# EAGLE design Trace_antenna_rfid_schem v1 (EAGLE 9.6.2)
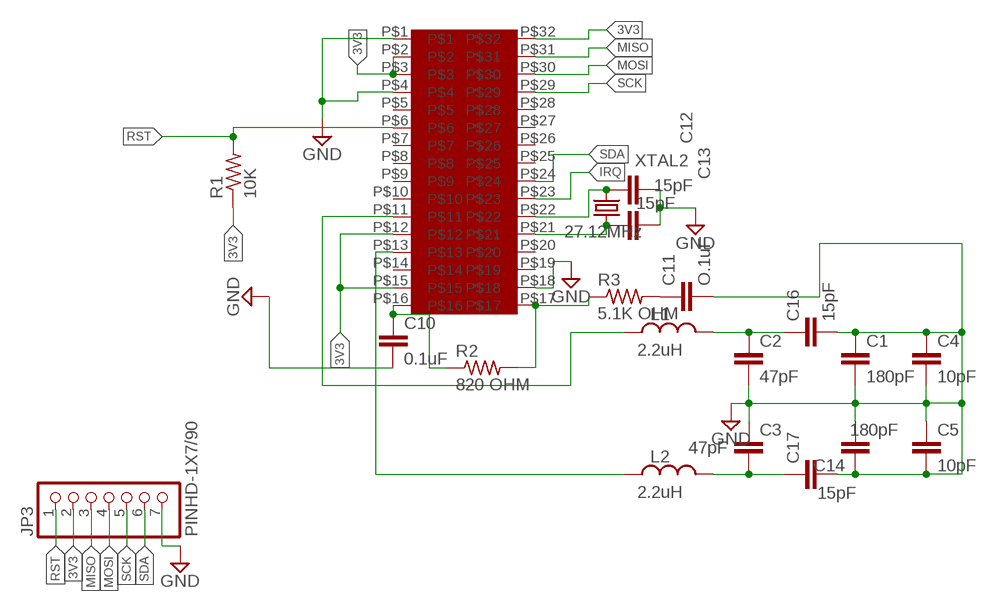
[diagram p0: schematic, sheet 1]

## Parts
C1  180pF  CAPACITOR_SMD_1206  [C1206]
C2  47pF  CAPACITOR_SMD_1206  [C1206]
C3  47pF  CAPACITOR_SMD_1206  [C1206]
C4  10pF  CAPACITOR_SMD_1206  [C1206]
C5  10pF  CAPACITOR_SMD_1206  [C1206]
C10  0.1uF  CAPACITOR_SMD_1206  [C1206]
C11  O.1uF  CAPACITOR_SMD_1206  [C1206]
C12  15pF  CAPACITOR_SMD_1206  [C1206]
C13  15pF  CAPACITOR_SMD_1206  [C1206]
C14  180pF  CAPACITOR_SMD_1206  [C1206]
C16  15pF  CAPACITOR_SMD_1206  [C1206]
C17  15pF  CAPACITOR_SMD_1206  [C1206]
JP3  PINHD-1X7/90  [1X07/90]
L1  2.2uH  L_CHIP-1206(3216-METRIC)  [INDC3216X190]
L2  2.2uH  L_CHIP-1206(3216-METRIC)  [INDC3216X190]
R1  10K  RESISTOR_SMD_1206  [M1206]
R2  820 OHM  RESISTOR_SMD_1206  [M1206]
R3  5.1K OHM  RESISTOR_SMD_1206  [M1206]
U$1  MFRC522_BREAKOUTBOARD  [BREAKOUT_BOARD_MFRC522]
XTAL2  27.12MHz  CRYSTAL_HC49-11.5L  [XTALRR488W45L1150T500H350B]

## Nets
3V3: JP3.2 R1.1 U$1.P$2 U$1.P$3 U$1.P$12 U$1.P$15 U$1.P$32
GND: C1.1 C1.2 C2.2 C3.1 C4.1 C4.2 C5.1 C5.2 C10.2 C11.2 C12.2 C13.2 C14.1 C14.2 C16.2 C17.2 JP3.7 U$1.P$1 U$1.P$4 U$1.P$18
IRQ: U$1.P$23
MISO: JP3.3 U$1.P$31
MOSI: JP3.4 U$1.P$30
N$1: C2.1 C16.1 L1.2
N$3: C3.2 C17.1 L2.2
N$15: C10.1 R2.1 U$1.P$16
N$16: R2.2 R3.1 U$1.P$17
N$17: C11.1 R3.2
N$18: C13.1 U$1.P$21 XTAL2.1
N$19: C12.1 U$1.P$22 XTAL2.2
N$20: L2.1 U$1.P$13
N$21: L1.1 U$1.P$11
RST: JP3.1 R1.2 U$1.P$6
SCK: JP3.5 U$1.P$29
SDA: JP3.6 U$1.P$24
Unconnected: U$1.P$5 U$1.P$7 U$1.P$8 U$1.P$9 U$1.P$10 U$1.P$14 U$1.P$19 U$1.P$20 U$1.P$25 U$1.P$26 U$1.P$27 U$1.P$28

## Library data of the parts
C1-C5 C10-C14 C16 C17 = BASIC_Components:CAPACITOR_SMD_1206
JP3 = Connector:PINHD-1X7: PIN HEADER; CATEGORY: CONNECTOR; SUB-CATEGORY: PIN-HEADER
L1 L2 = Inductor:L: Inductor Fixed - Generic; CATEGORY: Inductor; SUB-CATEGORY: Fixed
R1-R3 = BASIC_Components:RESISTOR_SMD_1206
U$1 = Breakout board mfrc522:MFRC522_BREAKOUTBOARD
XTAL2 = Frequency-Source:CRYSTAL: Crystal 2Pin - Generic; CATEGORY: Frequency-Source; SUB-CATEGORY: Crystal-2Pin; VALUE: HC49

## Board
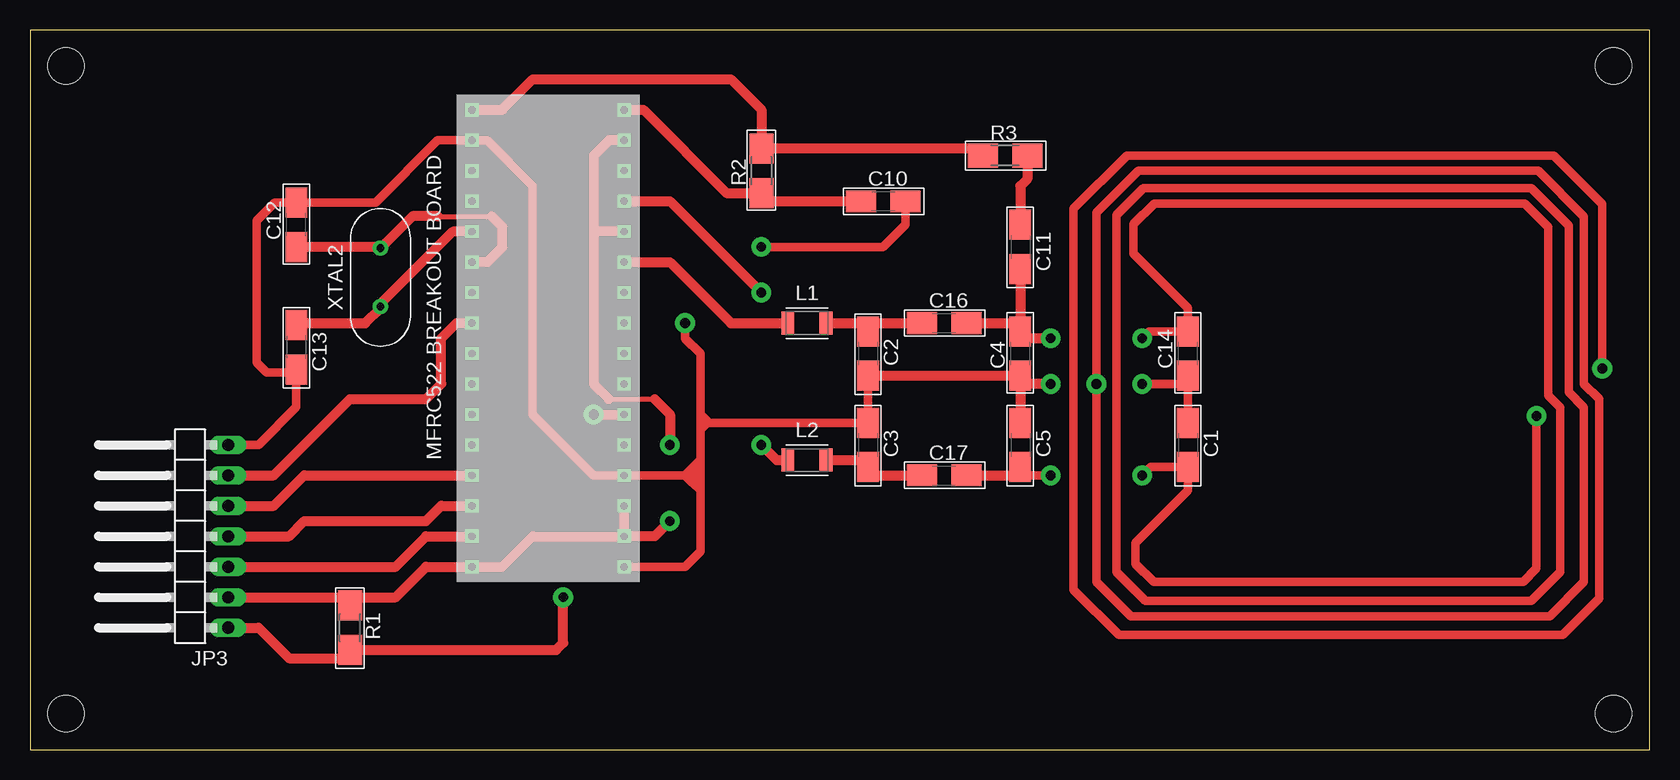
[diagram p1: board, top side]
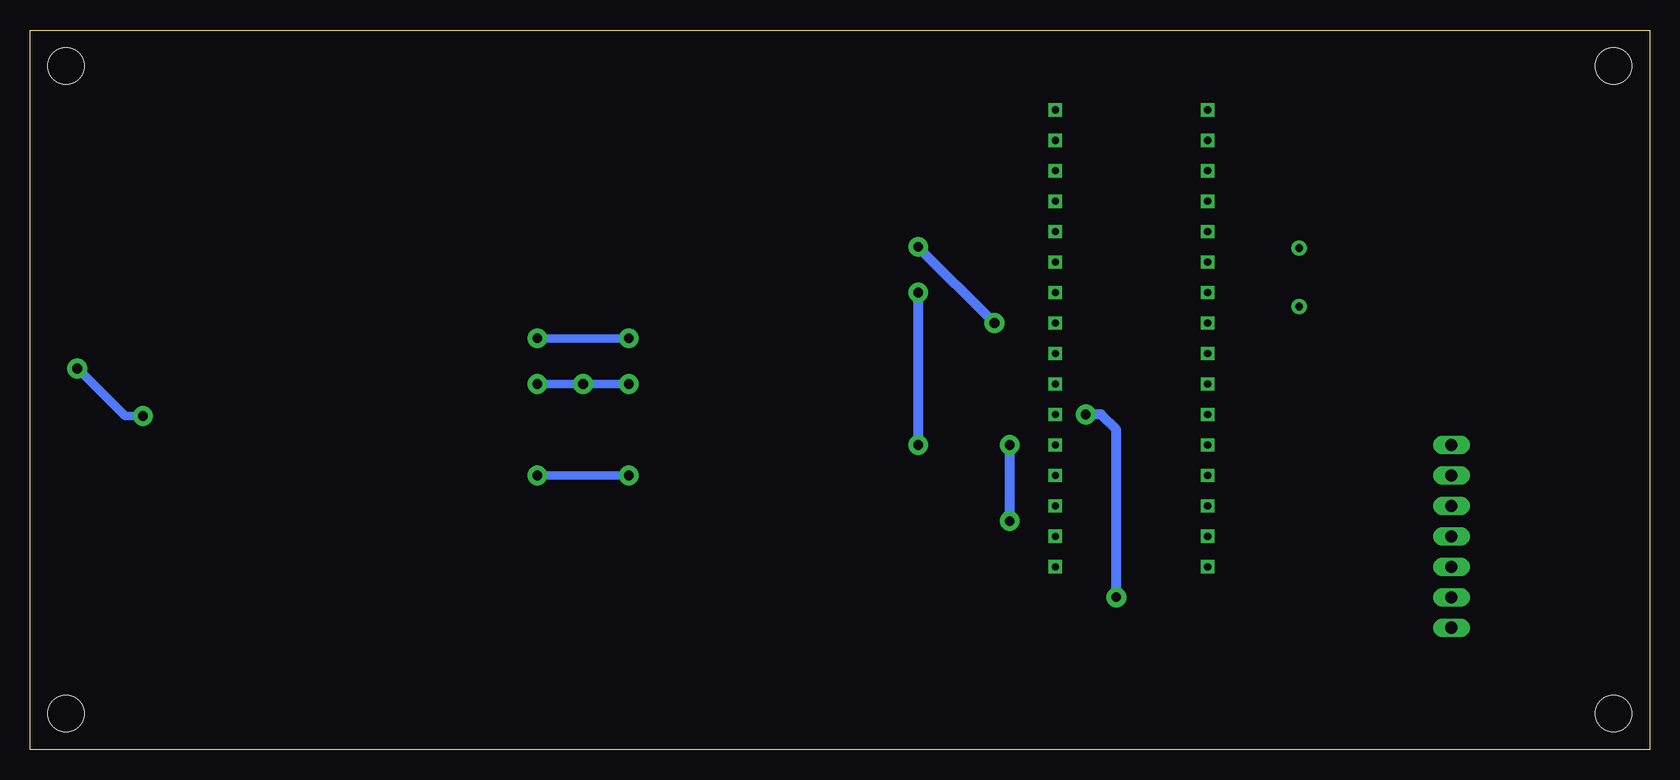
[diagram p2: board, bottom side, seen from below]

Size 135 x 60 mm. Coordinates in mm from the lower left corner, seen from the top.
Outline: 0,0 135,0 135,60 0,60 0,0
Copper layers (1*16): Top 0.035mm / dielectric 1.5mm / Bottom 0.035mm
Design rules "default *": minimum track width 6mil, minimum drill 0.35mm, track to track 16mil, track to pad 16mil, pad to pad 16mil, via to via 16mil, smd to smd 16mil, copper to edge 40mil, drill to drill 6mil, minimum pad ring 10mil, minimum via ring 8mil, stop-mask expansion 4mil, vias tented up to drill 0mil, thermal gap 10mil
Holes 3 mm at 3,57 3,3 132,57 132,3

### Footprints (pad centres in the part's own frame; a part is rotated, then mirrored left to right if it is on the bottom)
C1206 = smd 2.5 x 1.8: 1 -1.85,0; 2 1.85,0
1X07/90 = drill 1.016 long: 1 -7.62,-3.81; 2 -5.08,-3.81; 3 -2.54,-3.81; 4 0,-3.81; 5 2.54,-3.81; 6 5.08,-3.81; 7 7.62,-3.81
INDC3216X190 = smd 1.043 x 1.91: 1 -1.584,0; 2 1.584,0
M1206 = smd 2.5 x 2: 1 -1.85,0; 2 1.85,0
BREAKOUT_BOARD_MFRC522 = drill 0.6 square: P$1 -6.35,-10.16; P$2 -3.81,-10.16; P$3 -1.27,-10.16; P$4 1.27,-10.16; P$5 3.81,-10.16; P$6 6.35,-10.16; P$7 8.89,-10.16; P$8 11.43,-10.16; P$9 13.97,-10.16; P$10 16.51,-10.16; P$11 19.05,-10.16; P$12 21.59,-10.16; P$13 24.13,-10.16; P$14 26.67,-10.16; P$15 29.21,-10.16; P$16 31.75,-10.16; P$17 31.75,2.54; P$18 29.21,2.54; P$19 26.67,2.54; P$20 24.13,2.54; P$21 21.59,2.54; P$22 19.05,2.54; P$23 16.51,2.54; P$24 13.97,2.54; P$25 11.43,2.54; P$26 8.89,2.54; P$27 6.35,2.54; P$28 3.81,2.54; P$29 1.27,2.54; P$30 -1.27,2.54; P$31 -3.81,2.54; P$32 -6.35,2.54
XTALRR488W45L1150T500H350B = drill 0.657 pad 1.257: 1 -2.44,0; 2 2.44,0

### Placement (x,y rotation side)
C1  96.52,25.4 270 top
C2  69.85,33.02 270 top
C3  69.85,25.4 270 top
C4  82.55,33.02 90 top
C5  82.55,25.4 270 top
C10  71.12,45.72 0 top
C11  82.55,41.91 270 top
C12  22.2,43.76 90 top
C13  22.2,33.55 270 top
C14  96.52,33.02 90 top
C16  76.2,35.56 0 top
C17  76.2,22.86 0 top
JP3  12.7,17.78 90 top
L1  64.77,35.56 0 top
L2  64.77,24.13 0 top
R1  26.67,10.16 270 top
R2  60.96,48.26 90 top
R3  81.28,49.53 0 top
U$1  39.37,21.59 90 top
XTAL2  29.21,39.37 90 top

### Tracks (layer width: path | path; a pad name or v marks a point on that pad's centre or on a via)
3V3  (via drill 0.81 pad 1.65)
  Top 0.406: 25.98,12.7 R1.1 27.36,12.7 | 48.26,29.21 52.07,29.21
  Top 0.813: JP3.2 25.98,12.7 | 27.36,12.7 30.48,12.7 33.02,15.24 U$1.P$32 39.37,15.24 41.91,17.78 U$1.P$2 | 46.99,43.18 46.99,30.48 48.26,29.21 | 52.07,29.21 53.34,27.94 v53.34,25.4 | v53.34,19.05 52.07,17.78 U$1.P$2 | U$1.P$3 U$1.P$2 | U$1.P$15 48.26,50.8 46.99,49.53 46.99,43.18 | U$1.P$12 46.99,43.18
  Bottom 0.813: v53.34,25.4 v53.34,19.05
GND  (via drill 0.81 pad 1.65)
  Top 0.406: 81.86,35.56 C4.2 | C4.1 82.55,30.48
  Top 0.61: 55.88,25.4 55.88,22.86 | 55.24,23.5 55.88,22.86 | 55.24,22.23 55.88,22.86
  Top 0.7: C2.2 C3.1 56.57,27.25 56.52,27.3 | v88.9,30.48 88.9,13.97 91.75,11.12 126.69,11.12 129.54,13.97 129.54,28.52 128.27,29.79 128.27,43.7 125.16,46.8 92.81,46.8 90.56,44.56 90.56,14.8 92.96,12.4 125.16,12.4 127.56,14.8 127.56,28.52 126.56,29.52 126.56,43.57 124.61,45.52 93.72,45.52 92,43.8 92,41.35 96.52,36.83 C14.2 93.29,34.87 v92.71,34.29 | v88.9,30.48 | v88.9,30.48 88.9,44.78 92.38,48.26 125.73,48.26 129.54,44.45 129.54,30.48 130.81,29.21 130.81,12.6 127.76,9.55 90.75,9.55 87,13.31 87,45.09 91.44,49.53 127,49.53 131.06,45.47 v131.06,31.77 | v125.58,27.81 125.58,15.09 124.46,13.97 93.67,13.97 92.15,15.49 92.15,17.22 96.52,21.59 C1.2 93.4,23.55 v92.71,22.86 | 83.13,34.29 C4.2 | v85.09,22.86 83.24,22.86 | C1.1 C14.1 95.83,30.48 v92.71,30.48 | 81.86,31.17 82.55,30.48 | 54.61,22.86 U$1.P$4 46.99,22.86 41.91,27.94 41.91,46.99 38.1,50.8 U$1.P$18 33.98,50.8 28.8,45.61 C12.2 20.39,45.61 18.9,44.12 18.9,32.26 19.74,31.42 22.2,31.42 C13.2 22.2,28.55 19.05,25.4 JP3.7 | v54.61,35.56 54.61,34.29 55.88,33.02 55.88,27.94 | 55.88,27.94 55.88,26.67 | v60.96,41.91 71.12,41.91 72.97,43.76 C10.2 | U$1.P$1 54.61,15.24 55.88,16.51 55.88,21.59 | 56.52,27.3 55.88,27.94 | 56.52,27.3 55.88,26.67 | 55.88,26.67 55.88,25.4 55.88,24.13 | 55.88,22.86 55.88,24.13 | 55.88,22.86 55.88,21.59 | 55.88,21.59 55.24,22.23 54.61,22.86 | 54.61,22.86 55.88,22.86 | 54.61,22.86 55.24,23.5 55.88,24.13
  Top 0.813: C16.2 81.86,35.56 | C17.2 81.86,22.86 C5.2 83.24,22.86 | C5.1 82.55,30.48 v85.09,30.48 | v85.09,34.29 83.13,34.29 | C2.2 81.86,31.17 | C11.2 C4.2
  Bottom 0.7: v85.09,30.48 v88.9,30.48 v92.71,30.48 | v131.06,31.77 131.01,31.77 127.05,27.81 v125.58,27.81 | v92.71,34.29 v85.09,34.29 | v92.71,22.86 v85.09,22.86
  Bottom 0.813: v54.61,35.56 v60.96,41.91
MISO
  Top 0.813: U$1.P$31 33.02,17.78 30.48,15.24 JP3.3
MOSI
  Top 0.813: U$1.P$30 34.29,20.32 33.02,19.05 22.86,19.05 21.59,17.78 JP3.4
N$1
  Top 0.406: 69.16,35.56 C2.1 70.54,35.56
  Top 0.813: L1.2 69.16,35.56 | 70.54,35.56 C16.1
N$3
  Top 0.406: C3.2 70.54,22.86
  Top 0.813: L2.2 69.27,24.13 C3.2 | 70.54,22.86 C17.1
N$15
  Top 0.406: R2.1 61.65,45.72
  Top 0.813: U$1.P$16 51.13,53.34 58.06,46.41 R2.1 | 61.65,45.72 C10.1
N$16
  Top 0.813: U$1.P$17 39.37,53.34 41.91,55.88 58.42,55.88 60.96,53.34 R2.2 78.85,50.11 R3.1
N$17
  Top 0.813: R3.2 83.13,47.57 82.55,46.99 C11.1
N$18
  Top 0.406: 29.31,36.83 29.26,36.88 XTAL2.1 29.09,37.05
  Top 0.813: U$1.P$21 35.23,43.18 29.09,37.05 | C13.1 22.36,35.56 27.94,35.56 29.21,36.83 29.31,36.83
N$19
  Top 0.406: XTAL2.2 29.26,41.86 29.21,41.91 | 34.01,44.45 38.51,44.45
  Top 0.813: 29.26,41.86 31.88,44.48 33.98,44.48 34.01,44.45 | U$1.P$22 38.1,40.64 39.37,41.91 39.37,43.59 38.51,44.45 | 29.21,41.91 C12.1
N$20  (via drill 0.81 pad 1.65)
  Top 0.813: U$1.P$13 53.34,45.72 v60.96,38.1 | v60.96,25.4 62.23,24.13 L2.1
  Bottom 0.813: v60.96,38.1 v60.96,25.4
N$21
  Top 0.813: U$1.P$11 53.34,40.64 58.42,35.56 L1.1
RST  (via drill 0.81 pad 1.65)
  Top 0.406: 25.98,7.62 R1.2
  Top 0.813: JP3.1 19.05,10.16 21.59,7.62 25.98,7.62 | R1.2 43.87,8.31 44.45,8.89 v44.45,12.7 | v46.99,27.94 U$1.P$6
  Bottom 0.813: v44.45,12.7 44.45,26.67 45.72,27.94 v46.99,27.94
SCK
  Top 0.813: JP3.5 20.32,20.32 22.86,22.86 U$1.P$29
SDA
  Top 0.813: JP3.6 20.32,22.86 26.67,29.21 33.02,29.21 34.29,30.48 34.29,34.29 35.56,35.56 U$1.P$24